# Altium schematic sheet Sheet4.SchDoc
size A4
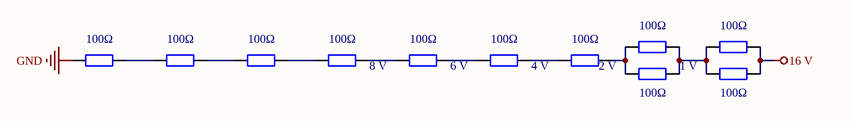
[diagram p0: Sheet4.SchDoc]

## Parts
(Parts that share a designator on the sheet are numbered #1, #2 ... from top to bottom, then left to right.)
R?#1  value 100Ω  [AXIAL-0.4]  (hidden comment: Res2)
R?#2  value 100Ω  [AXIAL-0.4]  (hidden comment: Res2)
R?#3  value 100Ω  [AXIAL-0.4]  (hidden comment: Res2)
R?#4  value 100Ω  [AXIAL-0.4]  (hidden comment: Res2)
R?#5  value 100Ω  [AXIAL-0.4]  (hidden comment: Res2)
R?#6  value 100Ω  [AXIAL-0.4]  (hidden comment: Res2)
R?#7  value 100Ω  [AXIAL-0.4]  (hidden comment: Res2)
R?#8  value 100Ω  [AXIAL-0.4]  (hidden comment: Res2)
R?#9  value 100Ω  [AXIAL-0.4]  (hidden comment: Res2)
R?#10  value 100Ω  [AXIAL-0.4]  (hidden comment: Res2)
R?#11  value 100Ω  [AXIAL-0.4]  (hidden comment: Res2)

## Nets
16 V: R?#2.2 R?#11.2
GND: R?#3.1
NetR?#1_1: R?#1.1 R?#9.2 R?#10.1
NetR?#1_2: R?#1.2 R?#2.1 R?#10.2 R?#11.1
NetR?#3_2: R?#3.2 R?#4.1
NetR?#4_2: R?#4.2 R?#5.1
NetR?#5_2: R?#5.2 R?#6.1
NetR?#6_2: R?#6.2 R?#7.1
NetR?#7_2: R?#7.2 R?#8.1
NetR?#8_2: R?#8.2 R?#9.1

## Notes on the sheet
- (near R?#6) 8 V
- (near R?#7) 6 V
- (near R?#8) 4 V
- (near R?#9) 2 V
- (near R?#10) 1 V

## Library data of the parts
R?#1-R?#11 = Res2: Resistor; Published: 8-Jun-2000; LatestRevisionDate: 17-Jul-2002; LatestRevisionNote: Re-released for DXP Platform.; PackageReference: AXIAL-0.4; Publisher: Altium Limited; PackageDescription: Axial Device, Thru-Hole; 2 Leads; 0.4 in Pin Spacing